# Altium project crouse_desisgn_ver1.PrjPcb
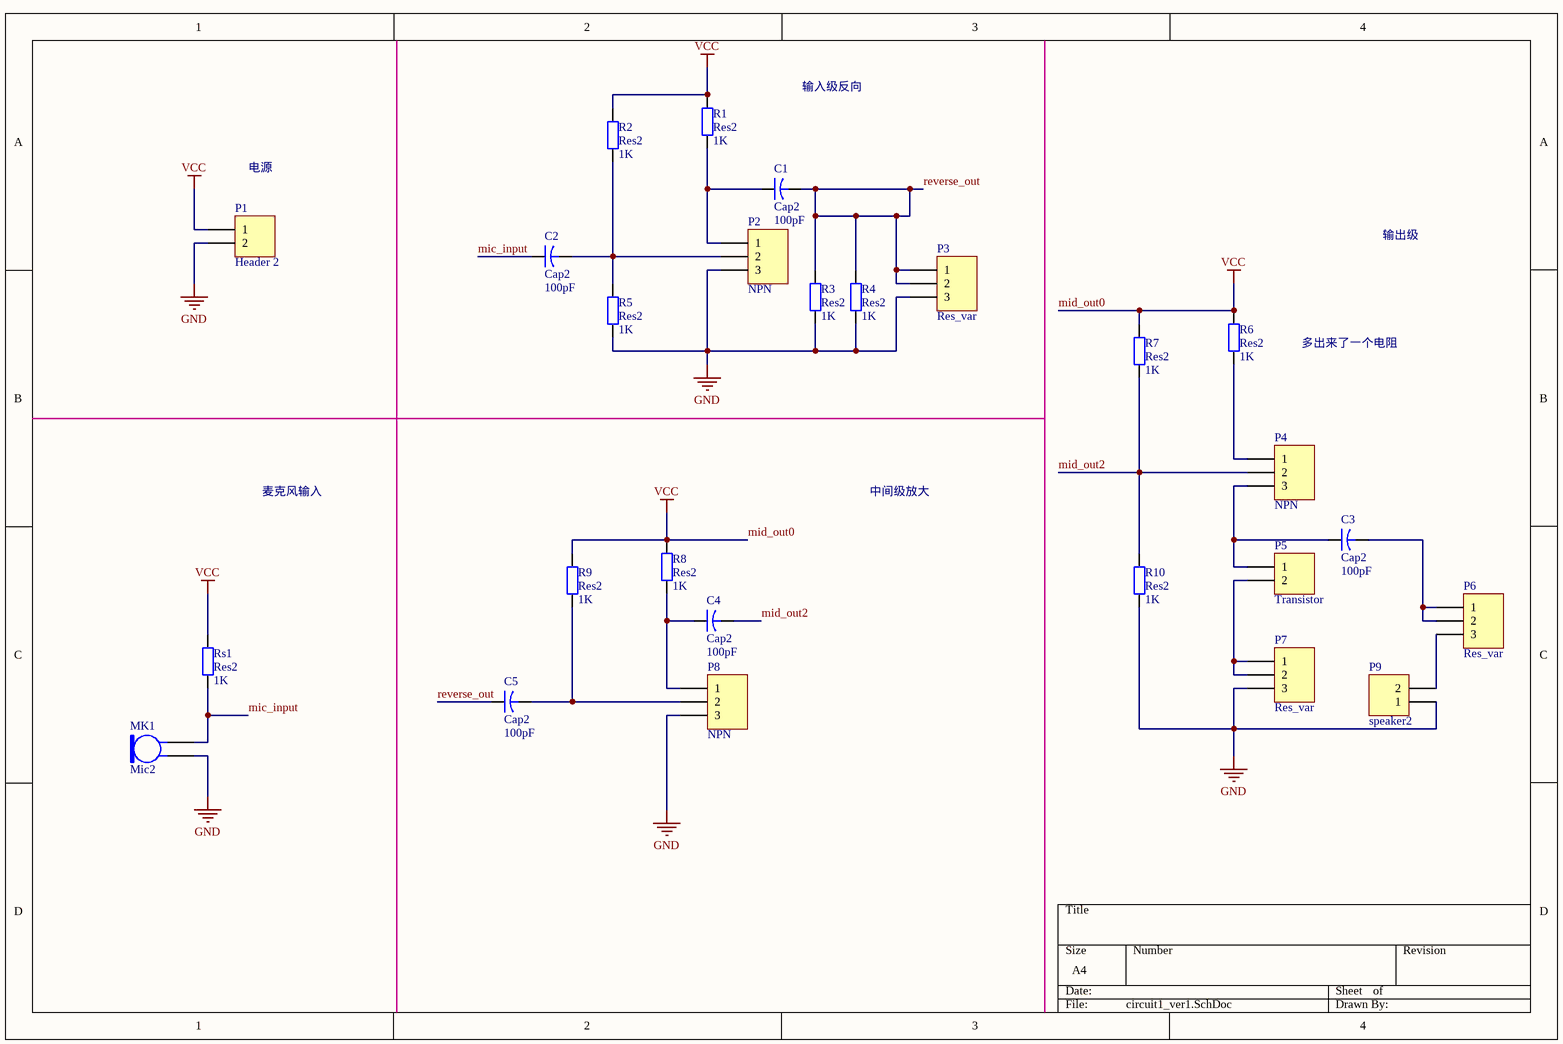
[diagram p0: circuit1_ver1.SchDoc]
4 sheets, 116 parts. Net scope: global (net labels, ports and power ports of the same name join across sheets).
Board files: circuit1_pcb_ver1.PcbDoc, circuit1_pcb_ver2.PcbDoc, circuit2_pcb_ver1.PcbDoc, circuit2_pcb_ver2.PcbDoc, all_circuits.PcbDoc, spare.PcbDoc
Sheets:
  circuit1_ver1.SchDoc
  circuit1_ver2.SchDoc
  circuit2_ver1.SchDoc
  circuit2_ver2.SchDoc

## Sheet circuit1_ver1.SchDoc
size A4

### Parts
C1  Cap2  value 100pF  [CAPR5-4X5]
C2  Cap2  value 100pF  [CAPR5-4X5]
C3  Cap2  value 100pF  [CAPR5-4X5]
C4  Cap2  value 100pF  [CAPR5-4X5]
C5  Cap2  value 100pF  [CAPR5-4X5]
MK1  Mic2  [PIN2]
P1  Header 2  [HDR1X2]
P2  NPN  [HDR1X3]
P3  Res_var  [HDR1X3]
P4  NPN  [HDR1X3]
P5  Transistor  [HDR1X2]
P6  Res_var  [HDR1X3]
P7  Res_var  [HDR1X3]
P8  NPN  [HDR1X3]
P9  speaker2  [HDR1X2]
R1  Res2  value 1K  [AXIAL-0.4]
R2  Res2  value 1K  [AXIAL-0.4]
R3  Res2  value 1K  [AXIAL-0.4]
R4  Res2  value 1K  [AXIAL-0.4]
R5  Res2  value 1K  [AXIAL-0.4]
R6  Res2  value 1K  [AXIAL-0.4]
R7  Res2  value 1K  [AXIAL-0.4]
R8  Res2  value 1K  [AXIAL-0.4]
R9  Res2  value 1K  [AXIAL-0.4]
R10  Res2  value 1K  [AXIAL-0.4]
Rs1  Res2  value 1K  [AXIAL-0.4]

### Nets
GND: MK1.1 P1.2 P2.3 P3.3 P7.3 P8.3 P9.1 R3.1 R4.1 R5.1 R10.1
mid_out0: P1.1 R1.2 R2.2 R6.2 R7.2 R8.2 R9.2 Rs1.2  [also labelled VCC]  [project net mid1_out1]
mic_input: C2.1 MK1.2 Rs1.1
mid_out2: C4.2 P4.2 R7.1 R10.2
reverse_out: C1.2 C5.1 P3.1 P3.2 R3.2 R4.2
NetC1_1: C1.1 P2.1 R1.1
NetC2_2: C2.2 P2.2 R2.1 R5.2
NetC3_1: C3.1 P4.3 P5.1
NetC3_2: C3.2 P6.1 P6.2
NetC4_1: C4.1 P8.1 R8.1
NetC5_2: C5.2 P8.2 R9.1
NetP4_1: P4.1 R6.1
NetP5_2: P5.2 P7.1 P7.2
NetP6_3: P6.3 P9.2

### Notes on the sheet
- 输入级反向
- 电源
- 输出级
- 多出来了一个电阻
- 麦克风输入
- 中间级放大

### Library data of the parts
C1-C5 = Cap2: Capacitor; Published: 23-Sep-2002; PackageReference: CAPR5-4X5; Publisher: Altium Limited; PackageDescription: Capacitor; 2 Leads
MK1 = Mic2: Microphone; Published: 24-Mar-1999; LatestRevisionDate: 17-Jul-2002; LatestRevisionNote: Re-released for DXP Platform.; PackageReference: PIN2; Publisher: Altium Limited
P1 P5 P9 = Header 2: Header, 2-Pin; LatestRevisionDate: 17-Jul-2002; LatestRevisionNote: Re-released for DXP Platform.; Publisher: Altium Limited
P2-P4 P6-P8 = Header 3: Header, 3-Pin; LatestRevisionDate: 17-Jul-2002; LatestRevisionNote: Re-released for DXP Platform.; Publisher: Altium Limited
R1-R10 Rs1 = Res2: Resistor; Published: 8-Jun-2000; LatestRevisionDate: 17-Jul-2002; LatestRevisionNote: Re-released for DXP Platform.; PackageReference: AXIAL-0.4; Publisher: Altium Limited; PackageDescription: Axial Device, Thru-Hole; 2 Leads; 0.4 in Pin Spacing

## Sheet circuit1_ver2.SchDoc
size A4
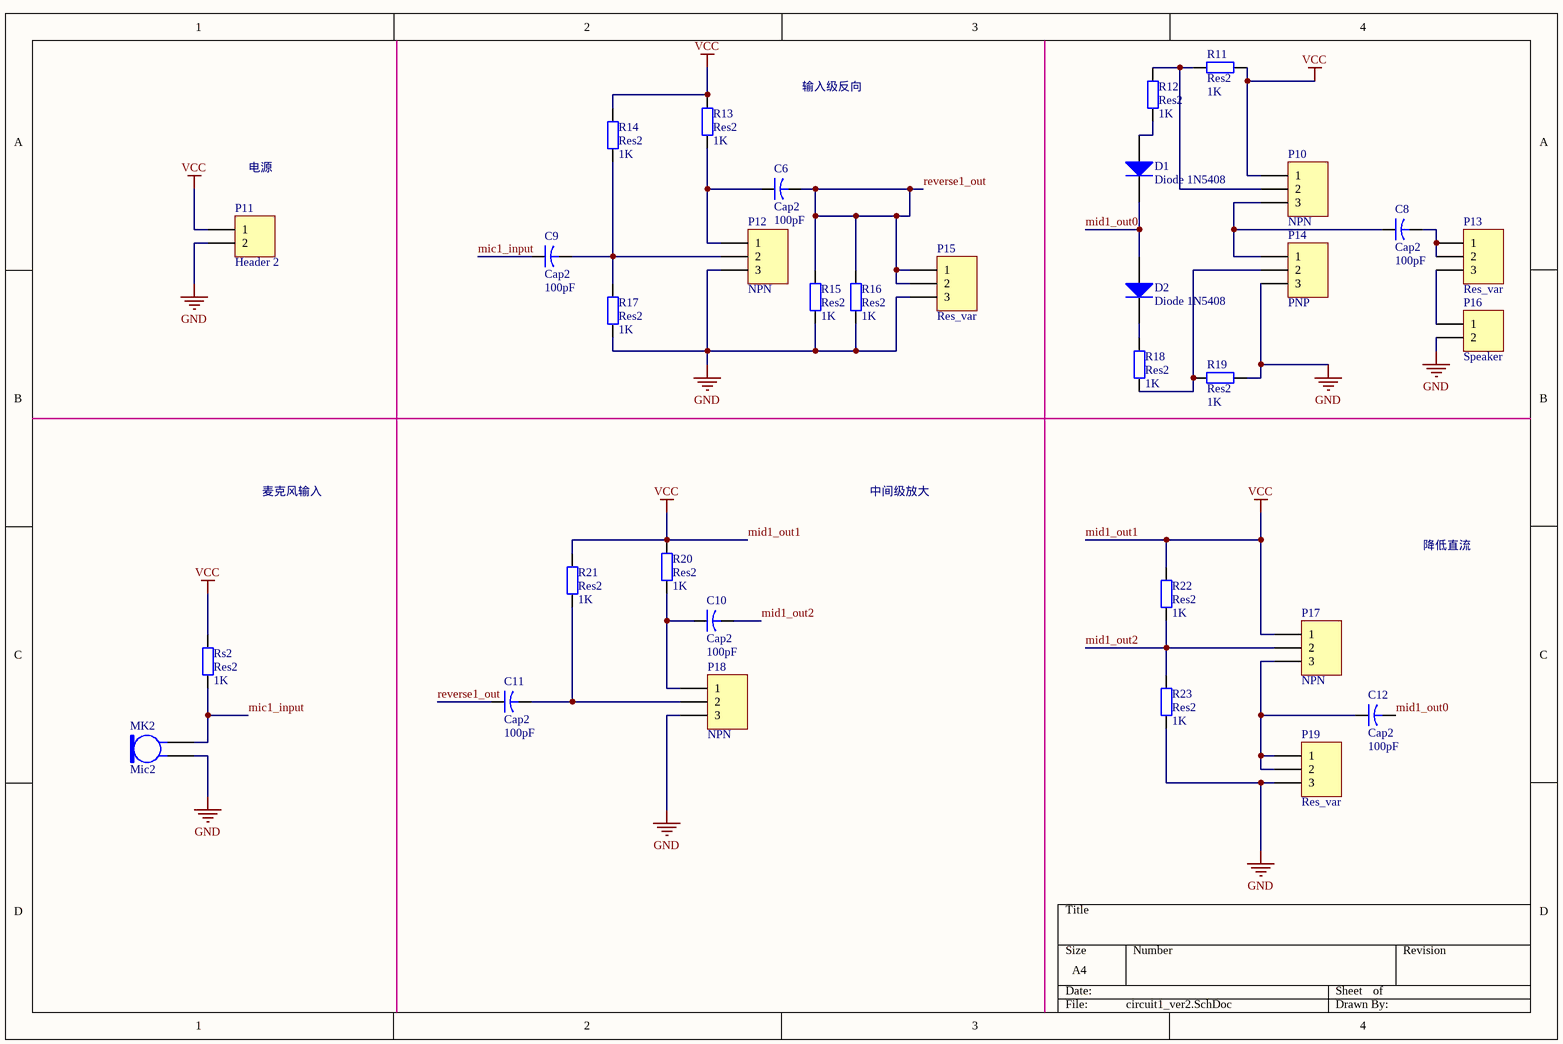
[diagram p1: circuit1_ver2.SchDoc]

### Parts
C6  Cap2  value 100pF  [CAPR5-4X5]
C8  Cap2  value 100pF  [CAPR5-4X5]
C9  Cap2  value 100pF  [CAPR5-4X5]
C10  Cap2  value 100pF  [CAPR5-4X5]
C11  Cap2  value 100pF  [CAPR5-4X5]
C12  Cap2  value 100pF  [CAPR5-4X5]
D1  Diode 1N5408  [DO-201AD]
D2  Diode 1N5408  [DO-201AD]
MK2  Mic2  [PIN2]
P10  NPN  [HDR1X3]
P11  Header 2  [HDR1X2]
P12  NPN  [HDR1X3]
P13  Res_var  [HDR1X3]
P14  PNP  [HDR1X3]
P15  Res_var  [HDR1X3]
P16  Speaker  [HDR1X2]
P17  NPN  [HDR1X3]
P18  NPN  [HDR1X3]
P19  Res_var  [HDR1X3]
R11  Res2  value 1K  [AXIAL-0.4]
R12  Res2  value 1K  [AXIAL-0.4]
R13  Res2  value 1K  [AXIAL-0.4]
R14  Res2  value 1K  [AXIAL-0.4]
R15  Res2  value 1K  [AXIAL-0.4]
R16  Res2  value 1K  [AXIAL-0.4]
R17  Res2  value 1K  [AXIAL-0.4]
R18  Res2  value 1K  [AXIAL-0.4]
R19  Res2  value 1K  [AXIAL-0.4]
R20  Res2  value 1K  [AXIAL-0.4]
R21  Res2  value 1K  [AXIAL-0.4]
R22  Res2  value 1K  [AXIAL-0.4]
R23  Res2  value 1K  [AXIAL-0.4]
Rs2  Res2  value 1K  [AXIAL-0.4]

### Nets
GND: MK2.1 P11.2 P12.3 P14.3 P15.3 P16.2 P18.3 P19.3 R15.1 R16.1 R17.1 R19.1 R23.1
mid1_out1: P10.1 P11.1 P17.1 R11.1 R13.2 R14.2 R20.2 R21.2 R22.2 Rs2.2  [also labelled VCC]
mic1_input: C9.1 MK2.2 Rs2.1
mid1_out0: C12.2 D1.2(K) D2.1(A)
mid1_out2: C10.2 P17.2 R22.1 R23.2
reverse1_out: C6.2 C11.1 P15.1 P15.2 R15.2 R16.2
NetC6_1: C6.1 P12.1 R13.1
NetC8_1: C8.1 P10.3 P14.1
NetC8_2: C8.2 P13.1 P13.2
NetC9_2: C9.2 P12.2 R14.1 R17.2
NetC10_1: C10.1 P18.1 R20.1
NetC11_2: C11.2 P18.2 R21.1
NetC12_1: C12.1 P17.3 P19.1 P19.2
NetD1_1: D1.1(A) R12.1
NetD2_2: D2.2(K) R18.2
NetP10_2: P10.2 R11.2 R12.2
NetP13_3: P13.3 P16.1
NetP14_2: P14.2 R18.1 R19.2

### Notes on the sheet
- 输入级反向
- 电源
- 麦克风输入
- 中间级放大
- 降低直流

### Library data of the parts
C6 C8-C12 = Cap2: Capacitor; Published: 23-Sep-2002; PackageReference: CAPR5-4X5; Publisher: Altium Limited; PackageDescription: Capacitor; 2 Leads
D1 D2 = Diode 1N5408: 3 Amp Medium Power Silicon Rectifier Diode; Published: 8-Jun-2000; LatestRevisionDate: 17-Jul-2002; LatestRevisionNote: Re-released for DXP Platform.; DatasheetVersion: Aug-1984; PackageReference: DO-201AD; Publisher: Altium Limited; PackageDescription: Diode, Axial; Body 9.5 x 5.3 mm (LxDia. max), Lead Dia. 1.32 mm (max); ComponentLink1Description: Manufacturer Link; ComponentLink1URL: http://www.irf.com/
MK2 = Mic2: Microphone; Published: 24-Mar-1999; LatestRevisionDate: 17-Jul-2002; LatestRevisionNote: Re-released for DXP Platform.; PackageReference: PIN2; Publisher: Altium Limited
P10 P12-P15 P17-P19 = Header 3: Header, 3-Pin; LatestRevisionDate: 17-Jul-2002; LatestRevisionNote: Re-released for DXP Platform.; Publisher: Altium Limited
P11 P16 = Header 2: Header, 2-Pin; LatestRevisionDate: 17-Jul-2002; LatestRevisionNote: Re-released for DXP Platform.; Publisher: Altium Limited
R11-R23 Rs2 = Res2: Resistor; Published: 8-Jun-2000; LatestRevisionDate: 17-Jul-2002; LatestRevisionNote: Re-released for DXP Platform.; PackageReference: AXIAL-0.4; Publisher: Altium Limited; PackageDescription: Axial Device, Thru-Hole; 2 Leads; 0.4 in Pin Spacing

## Sheet circuit2_ver1.SchDoc
size A4
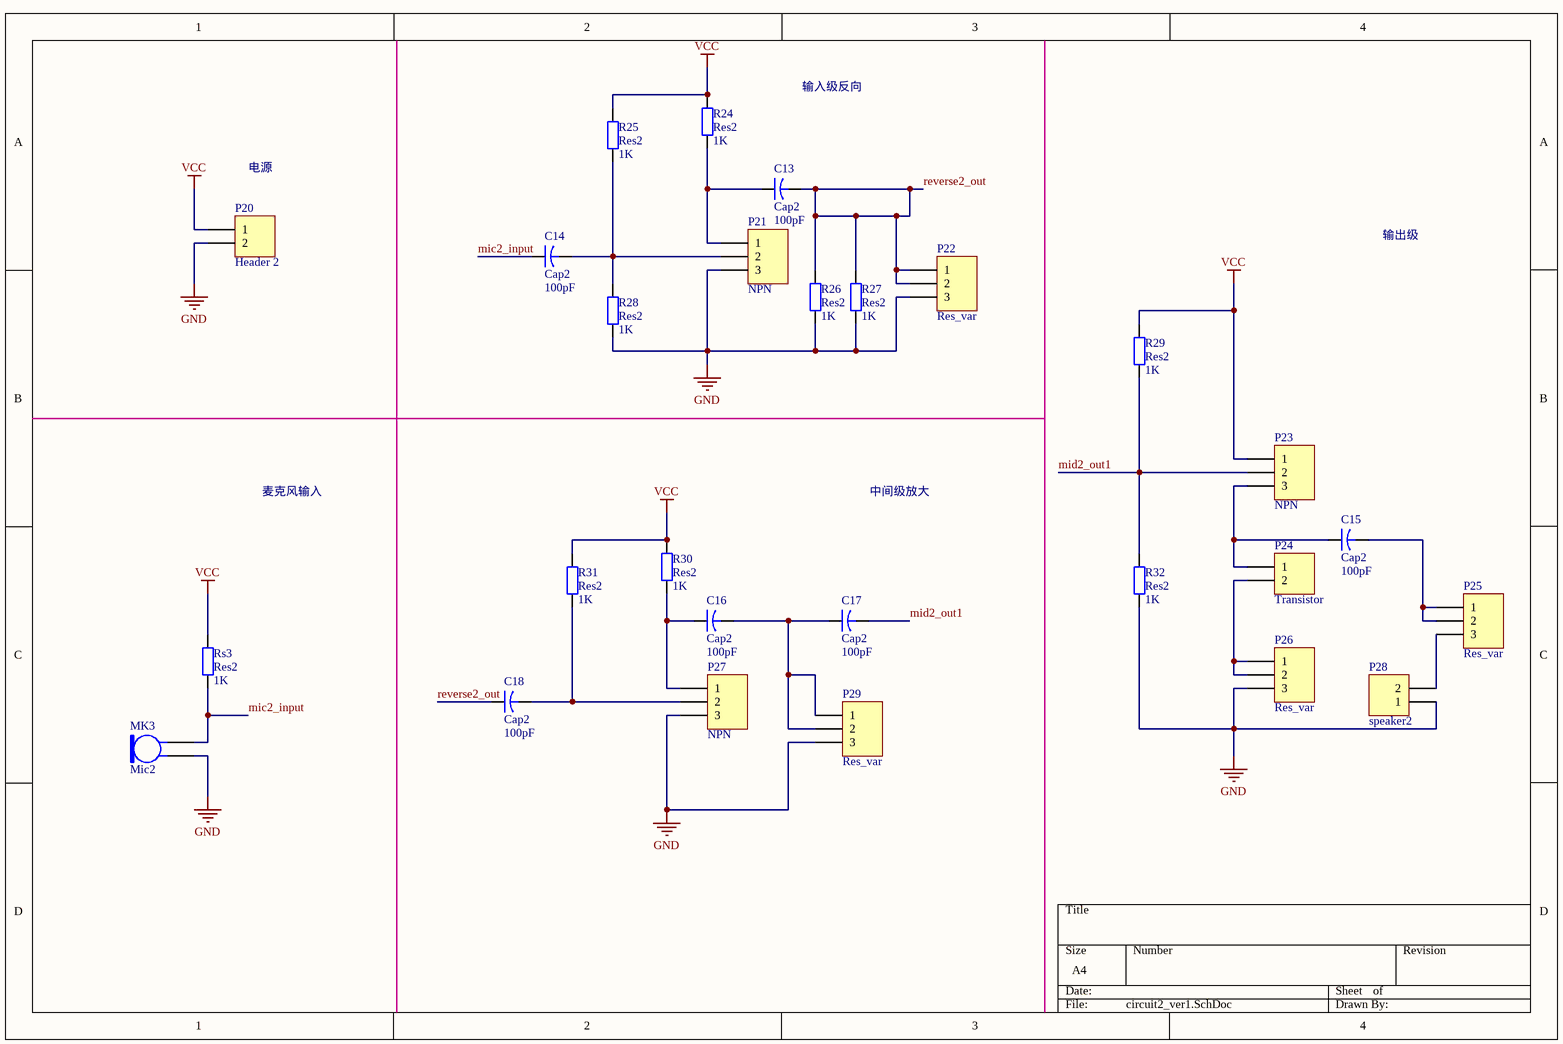
[diagram p2: circuit2_ver1.SchDoc]

### Parts
C13  Cap2  value 100pF  [CAPR5-4X5]
C14  Cap2  value 100pF  [CAPR5-4X5]
C15  Cap2  value 100pF  [CAPR5-4X5]
C16  Cap2  value 100pF  [CAPR5-4X5]
C17  Cap2  value 100pF  [CAPR5-4X5]
C18  Cap2  value 100pF  [CAPR5-4X5]
MK3  Mic2  [PIN2]
P20  Header 2  [HDR1X2]
P21  NPN  [HDR1X3]
P22  Res_var  [HDR1X3]
P23  NPN  [HDR1X3]
P24  Transistor  [HDR1X2]
P25  Res_var  [HDR1X3]
P26  Res_var  [HDR1X3]
P27  NPN  [HDR1X3]
P28  speaker2  [HDR1X2]
P29  Res_var  [HDR1X3]
R24  Res2  value 1K  [AXIAL-0.4]
R25  Res2  value 1K  [AXIAL-0.4]
R26  Res2  value 1K  [AXIAL-0.4]
R27  Res2  value 1K  [AXIAL-0.4]
R28  Res2  value 1K  [AXIAL-0.4]
R29  Res2  value 1K  [AXIAL-0.4]
R30  Res2  value 1K  [AXIAL-0.4]
R31  Res2  value 1K  [AXIAL-0.4]
R32  Res2  value 1K  [AXIAL-0.4]
Rs3  Res2  value 1K  [AXIAL-0.4]

### Nets
GND: MK3.1 P20.2 P21.3 P22.3 P26.3 P27.3 P28.1 P29.3 R26.1 R27.1 R28.1 R32.1
VCC: P20.1 P23.1 R24.2 R25.2 R29.2 R30.2 R31.2 Rs3.2  [project net mid1_out1]
mic2_input: C14.1 MK3.2 Rs3.1
mid2_out1: C17.2 P23.2 R29.1 R32.2
reverse2_out: C13.2 C18.1 P22.1 P22.2 R26.2 R27.2
NetC13_1: C13.1 P21.1 R24.1
NetC14_2: C14.2 P21.2 R25.1 R28.2
NetC15_1: C15.1 P23.3 P24.1
NetC15_2: C15.2 P25.1 P25.2
NetC16_1: C16.1 P27.1 R30.1
NetC16_2: C16.2 C17.1 P29.1 P29.2
NetC18_2: C18.2 P27.2 R31.1
NetP24_2: P24.2 P26.1 P26.2
NetP25_3: P25.3 P28.2

### Notes on the sheet
- 输入级反向
- 电源
- 输出级
- 麦克风输入
- 中间级放大

### Library data of the parts
C13-C18 = Cap2: Capacitor; Published: 23-Sep-2002; PackageReference: CAPR5-4X5; Publisher: Altium Limited; PackageDescription: Capacitor; 2 Leads
MK3 = Mic2: Microphone; Published: 24-Mar-1999; LatestRevisionDate: 17-Jul-2002; LatestRevisionNote: Re-released for DXP Platform.; PackageReference: PIN2; Publisher: Altium Limited
P20 P24 P28 = Header 2: Header, 2-Pin; LatestRevisionDate: 17-Jul-2002; LatestRevisionNote: Re-released for DXP Platform.; Publisher: Altium Limited
P21-P23 P25-P27 P29 = Header 3: Header, 3-Pin; LatestRevisionDate: 17-Jul-2002; LatestRevisionNote: Re-released for DXP Platform.; Publisher: Altium Limited
R24-R32 Rs3 = Res2: Resistor; Published: 8-Jun-2000; LatestRevisionDate: 17-Jul-2002; LatestRevisionNote: Re-released for DXP Platform.; PackageReference: AXIAL-0.4; Publisher: Altium Limited; PackageDescription: Axial Device, Thru-Hole; 2 Leads; 0.4 in Pin Spacing

## Sheet circuit2_ver2.SchDoc
size A4
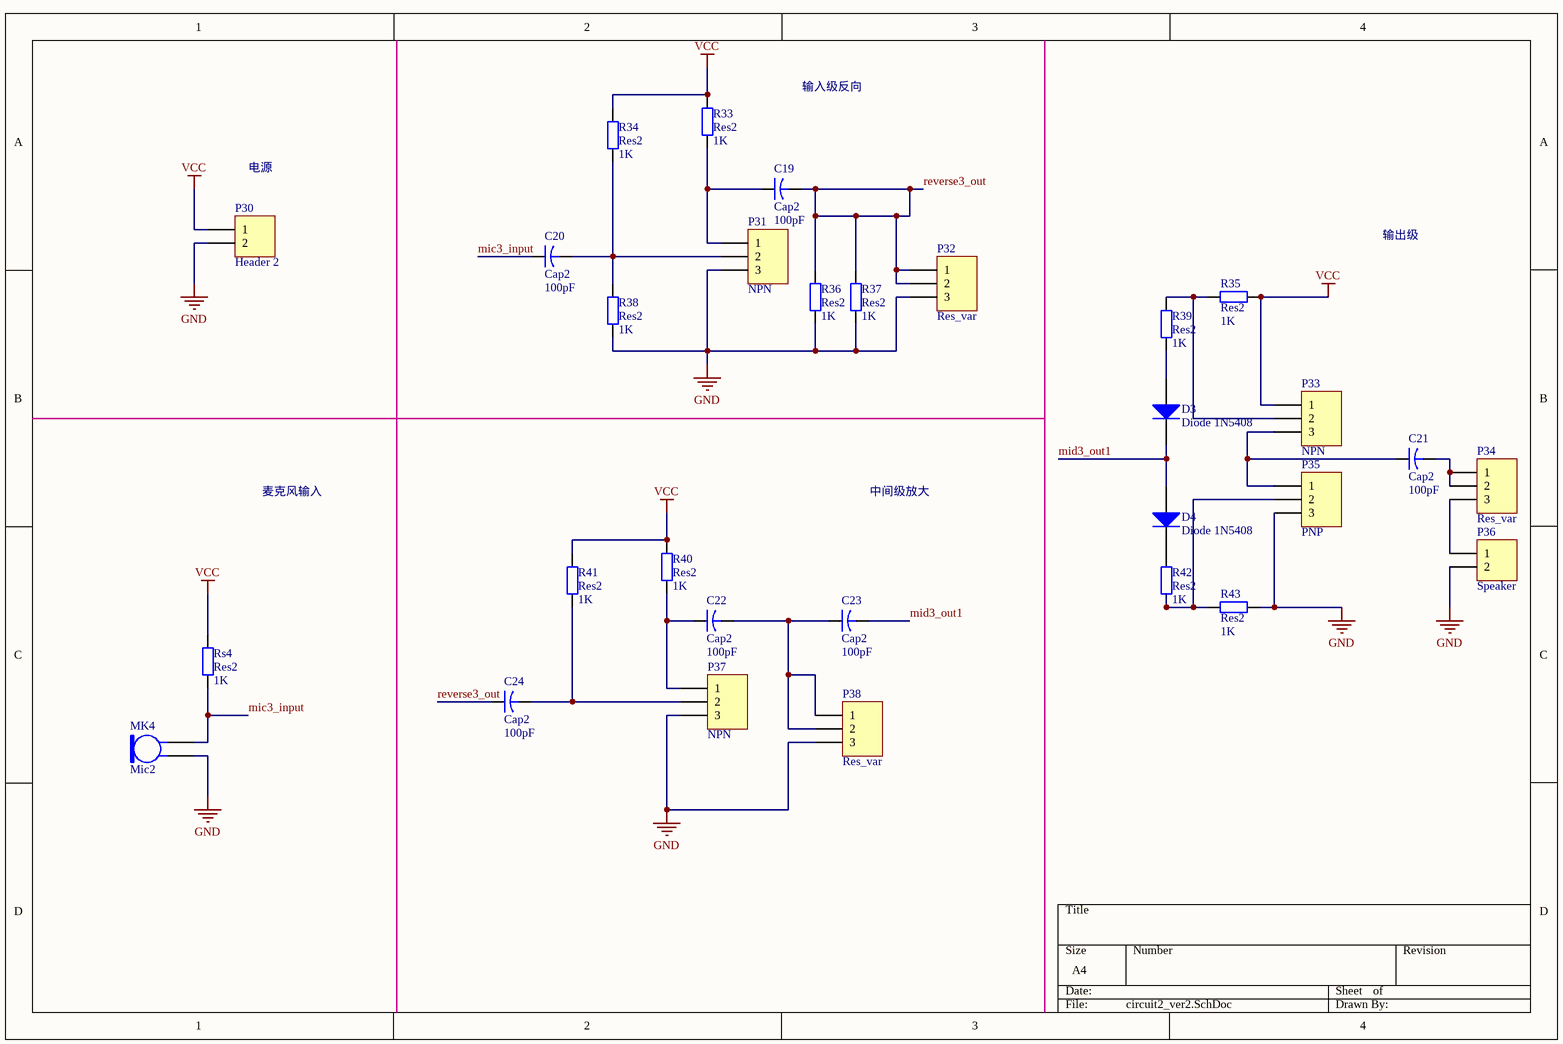
[diagram p3: circuit2_ver2.SchDoc]

### Parts
C19  Cap2  value 100pF  [CAPR5-4X5]
C20  Cap2  value 100pF  [CAPR5-4X5]
C21  Cap2  value 100pF  [CAPR5-4X5]
C22  Cap2  value 100pF  [CAPR5-4X5]
C23  Cap2  value 100pF  [CAPR5-4X5]
C24  Cap2  value 100pF  [CAPR5-4X5]
D3  Diode 1N5408  [DO-201AD]
D4  Diode 1N5408  [DO-201AD]
MK4  Mic2  [PIN2]
P30  Header 2  [HDR1X2]
P31  NPN  [HDR1X3]
P32  Res_var  [HDR1X3]
P33  NPN  [HDR1X3]
P34  Res_var  [HDR1X3]
P35  PNP  [HDR1X3]
P36  Speaker  [HDR1X2]
P37  NPN  [HDR1X3]
P38  Res_var  [HDR1X3]
R33  Res2  value 1K  [AXIAL-0.4]
R34  Res2  value 1K  [AXIAL-0.4]
R35  Res2  value 1K  [AXIAL-0.4]
R36  Res2  value 1K  [AXIAL-0.4]
R37  Res2  value 1K  [AXIAL-0.4]
R38  Res2  value 1K  [AXIAL-0.4]
R39  Res2  value 1K  [AXIAL-0.4]
R40  Res2  value 1K  [AXIAL-0.4]
R41  Res2  value 1K  [AXIAL-0.4]
R42  Res2  value 1K  [AXIAL-0.4]
R43  Res2  value 1K  [AXIAL-0.4]
Rs4  Res2  value 1K  [AXIAL-0.4]

### Nets
GND: MK4.1 P30.2 P31.3 P32.3 P35.3 P36.2 P37.3 P38.3 R36.1 R37.1 R38.1 R43.1
VCC: P30.1 P33.1 R33.2 R34.2 R35.1 R40.2 R41.2 Rs4.2  [project net mid1_out1]
mic3_input: C20.1 MK4.2 Rs4.1
mid3_out1: C23.2 D3.2(K) D4.1(A)
reverse3_out: C19.2 C24.1 P32.1 P32.2 R36.2 R37.2
NetC19_1: C19.1 P31.1 R33.1
NetC20_2: C20.2 P31.2 R34.1 R38.2
NetC21_1: C21.1 P33.3 P35.1
NetC21_2: C21.2 P34.1 P34.2
NetC22_1: C22.1 P37.1 R40.1
NetC22_2: C22.2 C23.1 P38.1 P38.2
NetC24_2: C24.2 P37.2 R41.1
NetD3_1: D3.1(A) R39.1
NetD4_2: D4.2(K) R42.2
NetP33_2: P33.2 R35.2 R39.2
NetP34_3: P34.3 P36.1
NetP35_2: P35.2 R42.1 R43.2

### Notes on the sheet
- 输入级反向
- 电源
- 输出级
- 麦克风输入
- 中间级放大

### Library data of the parts
C19-C24 = Cap2: Capacitor; Published: 23-Sep-2002; PackageReference: CAPR5-4X5; Publisher: Altium Limited; PackageDescription: Capacitor; 2 Leads
D3 D4 = Diode 1N5408: as D1 on sheet circuit1_ver2; Published: 8-Jun-2000; LatestRevisionDate: 17-Jul-2002; LatestRevisionNote: Re-released for DXP Platform.; DatasheetVersion: Aug-1984; PackageReference: DO-201AD; Publisher: Altium Limited; PackageDescription: Diode, Axial; Body 9.5 x 5.3 mm (LxDia. max), Lead Dia. 1.32 mm (max); ComponentLink1Description: Manufacturer Link; ComponentLink1URL: http://www.irf.com/
MK4 = Mic2: Microphone; Published: 24-Mar-1999; LatestRevisionDate: 17-Jul-2002; LatestRevisionNote: Re-released for DXP Platform.; PackageReference: PIN2; Publisher: Altium Limited
P30 P36 = Header 2: Header, 2-Pin; LatestRevisionDate: 17-Jul-2002; LatestRevisionNote: Re-released for DXP Platform.; Publisher: Altium Limited
P31-P35 P37 P38 = Header 3: Header, 3-Pin; LatestRevisionDate: 17-Jul-2002; LatestRevisionNote: Re-released for DXP Platform.; Publisher: Altium Limited
R33-R43 Rs4 = Res2: Resistor; Published: 8-Jun-2000; LatestRevisionDate: 17-Jul-2002; LatestRevisionNote: Re-released for DXP Platform.; PackageReference: AXIAL-0.4; Publisher: Altium Limited; PackageDescription: Axial Device, Thru-Hole; 2 Leads; 0.4 in Pin Spacing

## Nets that join several sheets
GND: circuit1_ver1 (11 pins), circuit1_ver2 (13 pins), circuit2_ver1 (12 pins), circuit2_ver2 (12 pins)
mid1_out1: circuit1_ver1 (8 pins), circuit1_ver2 (10 pins), circuit2_ver1 (8 pins), circuit2_ver2 (8 pins)